# Altium schematic sheet ComboCamera.SchDoc: Combo Camera
size A4; Revision: 1; SheetNumber: 1; SheetTotal: 1; SheetSize: A4
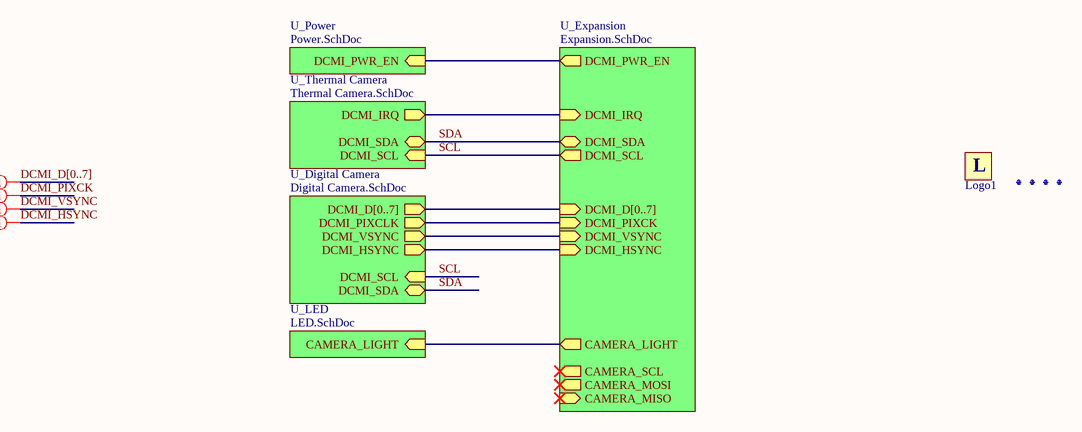
[diagram p0: ComboCamera.SchDoc]

## Parts
Fid1  Fiducial mark  [Fiducial]  (value not drawn)  (no BOM)
Fid2  Fiducial mark  [Fiducial]  (value not drawn)  (no BOM)
Fid3  Fiducial mark  [Fiducial]  (value not drawn)  (no BOM)
Fid4  Fiducial mark  [Fiducial]  (value not drawn)  (no BOM)
Logo1  Logo symbol  [LOGO_YILDIZIOT]  (value not drawn)  (no BOM)

## Sub-sheets
U_Digital Camera = Digital Camera.SchDoc: DCMI_D[0..7] (out), DCMI_PIXCLK (out), DCMI_VSYNC (out), DCMI_HSYNC (out), DCMI_SCL (in), DCMI_SDA (bidir)
U_Expansion = Expansion.SchDoc: DCMI_IRQ (in), DCMI_D[0..7] (in), DCMI_PWR_EN (out), DCMI_VSYNC (in), DCMI_HSYNC (in), DCMI_PIXCK (in), DCMI_SDA (bidir), DCMI_SCL (out), CAMERA_SCL (out), CAMERA_MISO (in), CAMERA_MOSI (out), CAMERA_LIGHT (out)
U_LED = LED.SchDoc: CAMERA_LIGHT (in)
U_Power = Power.SchDoc: DCMI_PWR_EN (in)
U_Thermal Camera = Thermal Camera.SchDoc: DCMI_IRQ (out), DCMI_SDA (bidir), DCMI_SCL (in)

## Nets
SCL: sheet U_Digital Camera/DCMI_SCL, sheet U_Thermal Camera/DCMI_SCL, sheet U_Expansion/DCMI_SCL
SDA: sheet U_Digital Camera/DCMI_SDA, sheet U_Thermal Camera/DCMI_SDA, sheet U_Expansion/DCMI_SDA
(unnamed): sheet U_Power/DCMI_PWR_EN, sheet U_Expansion/DCMI_PWR_EN
(unnamed): sheet U_Digital Camera/DCMI_PIXCLK, sheet U_Expansion/DCMI_PIXCK
(unnamed): sheet U_Digital Camera/DCMI_VSYNC, sheet U_Expansion/DCMI_VSYNC
(unnamed): sheet U_Digital Camera/DCMI_HSYNC, sheet U_Expansion/DCMI_HSYNC
(unnamed): sheet U_Thermal Camera/DCMI_IRQ, sheet U_Expansion/DCMI_IRQ
(unnamed): sheet U_Expansion/CAMERA_LIGHT, sheet U_LED/CAMERA_LIGHT

## Buses and harness runs
bus DCMI_D[0..7]
bus sheet U_Digital Camera/DCMI_D[0..7] = sheet U_Expansion/DCMI_D[0..7]

## Layout directives
rule Matched Net Lengths [Tolerance = 100mil]; net class DCMI: (no net found under the mark), DCMI_HSYNC, DCMI_PIXCK, DCMI_VSYNC

## Notes on the sheet
- Title:
- Size:
- Project:
- Revision:
- Sheet
- of
- Date:
- YıLDıZ IoT
- Elperek Mahallesi
- Saray Sokak, No:12
- SAKARYA / TURKEY
- File:
- (in symbol Logo) L

## Library data of the parts
Fid1-Fid4 = Fiducial: Part Number: Fid-Mark; Artikkelnr Noca: N.A.; Manufacturer: *; Manufacturer Part Number: *; Datasheet: *; LatestRevisionDate: 2009-12-12; Pin Count: 1; Publisher: Nordic Semiconductor; Published: 2009-12-12; Value: *; Note: *; Supplier: *; Supplier part number: *; 2nd source Supplier: *; 2nd source part number: *; Footprint Doc: Fiducial; Artikkelnr Simpro: N.A.
Logo1 = Logo: Schematic symbol for Logo